# Altium schematic sheet 05 SOC_PWR.SchDoc
size 513 x 386 mm
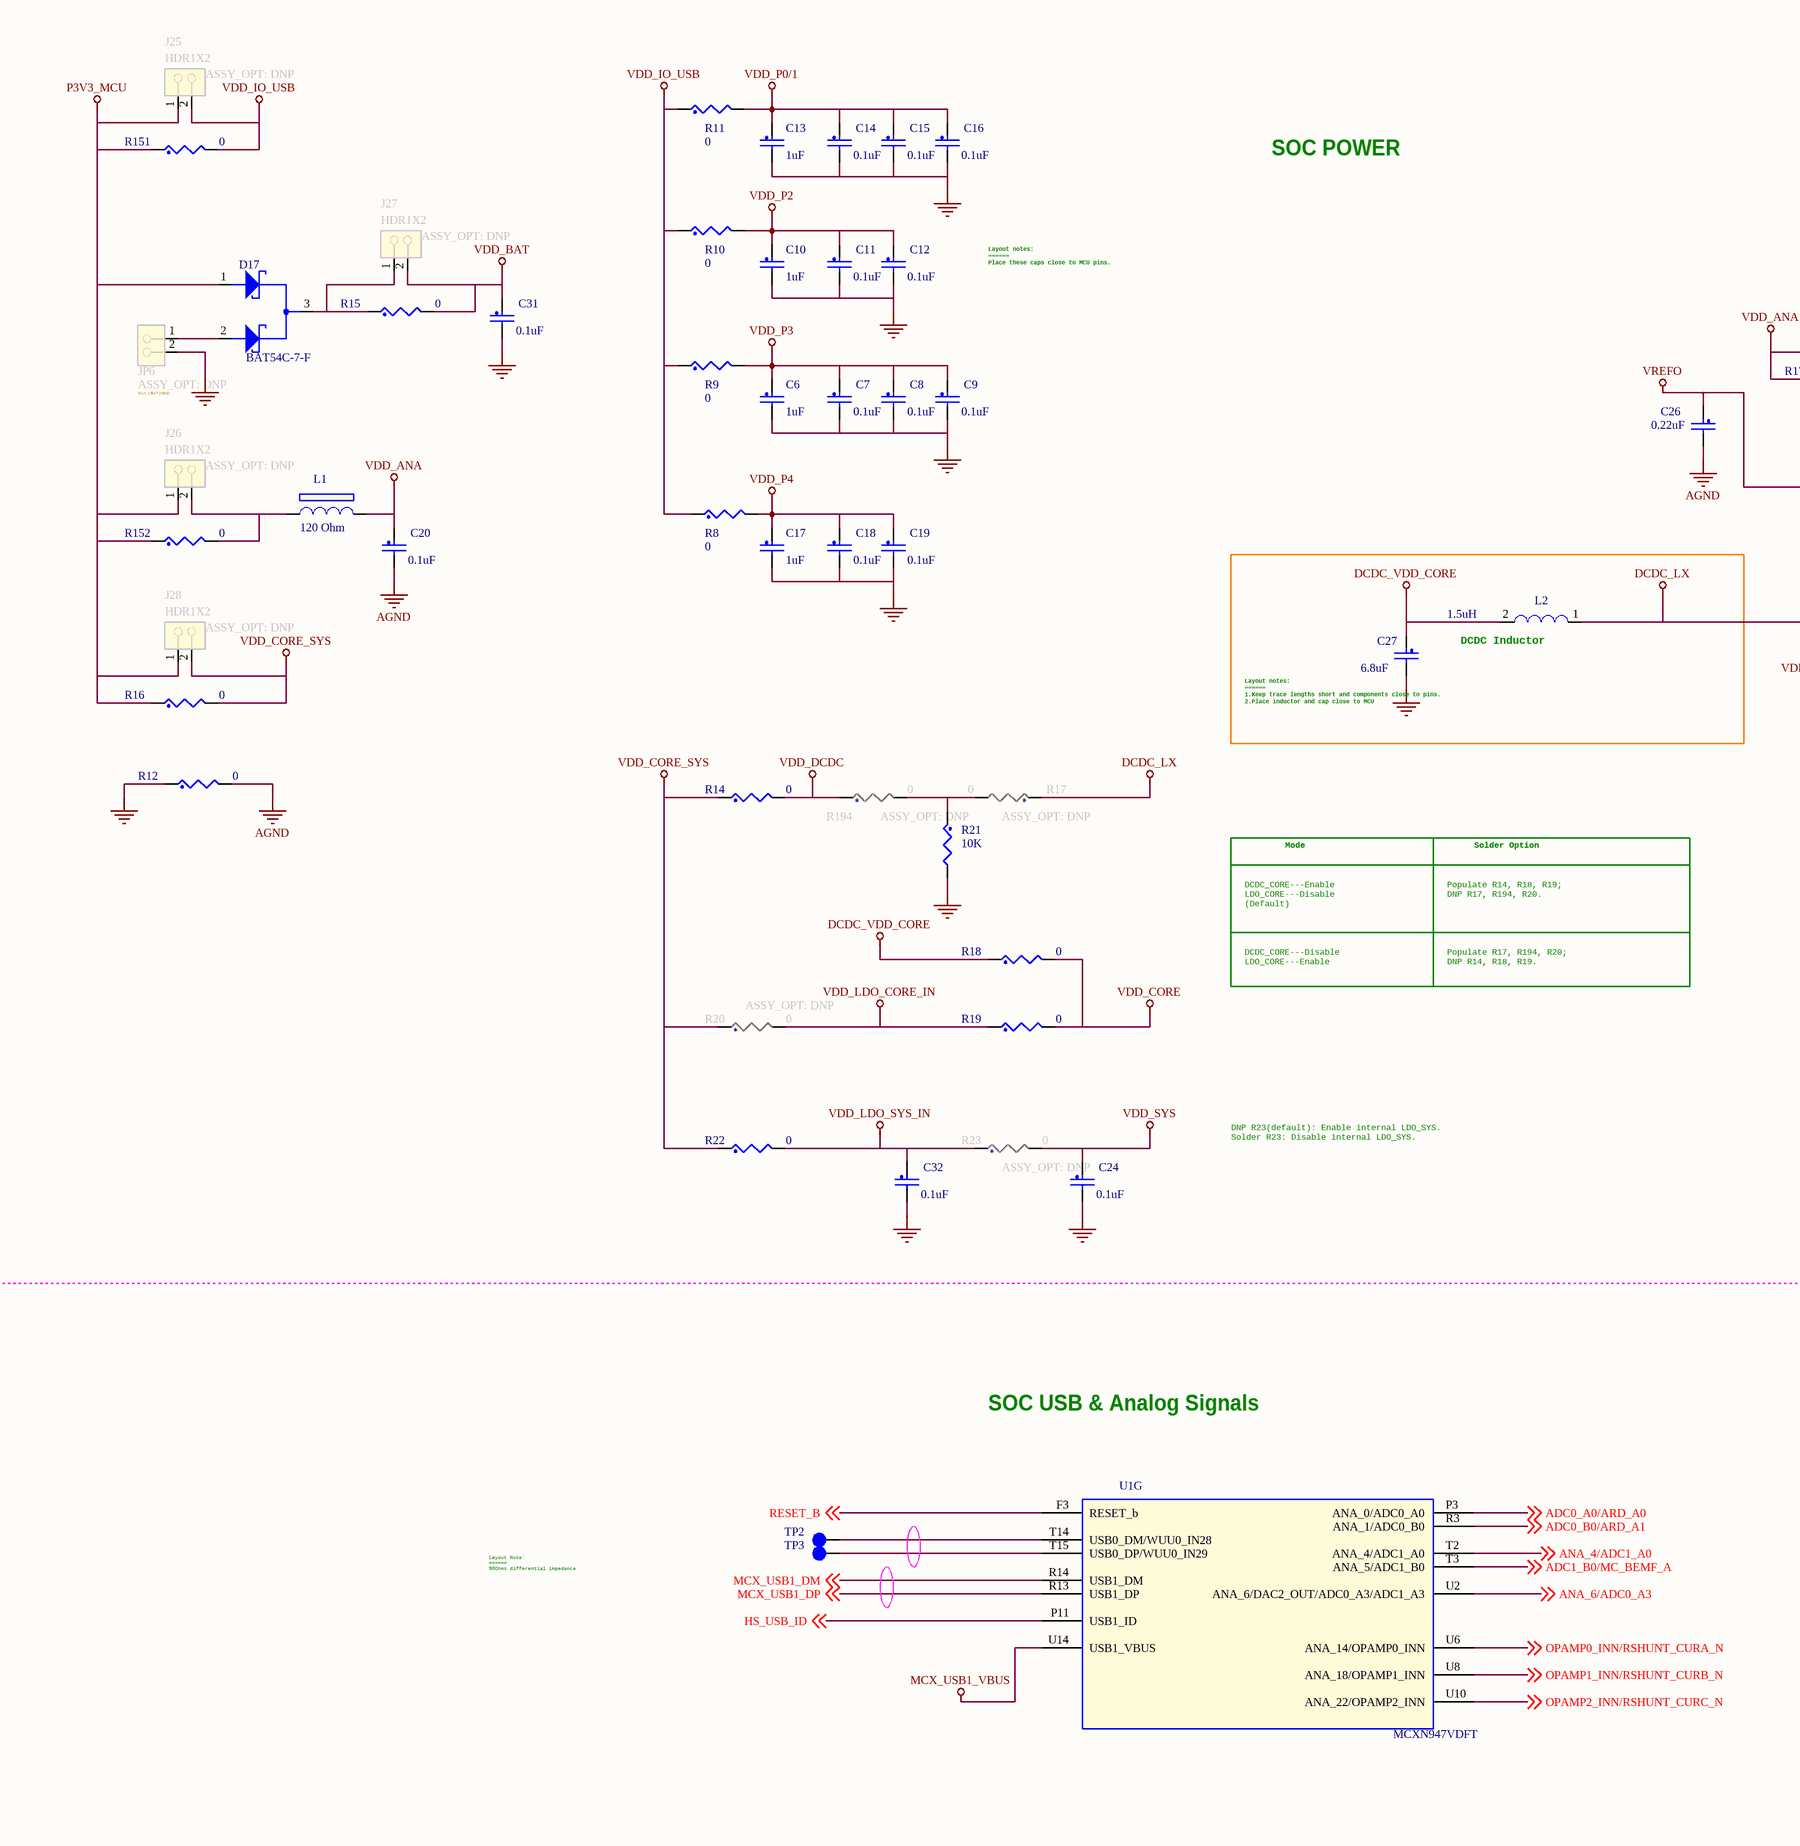
[diagram p0: 05 SOC_PWR.SchDoc, left]
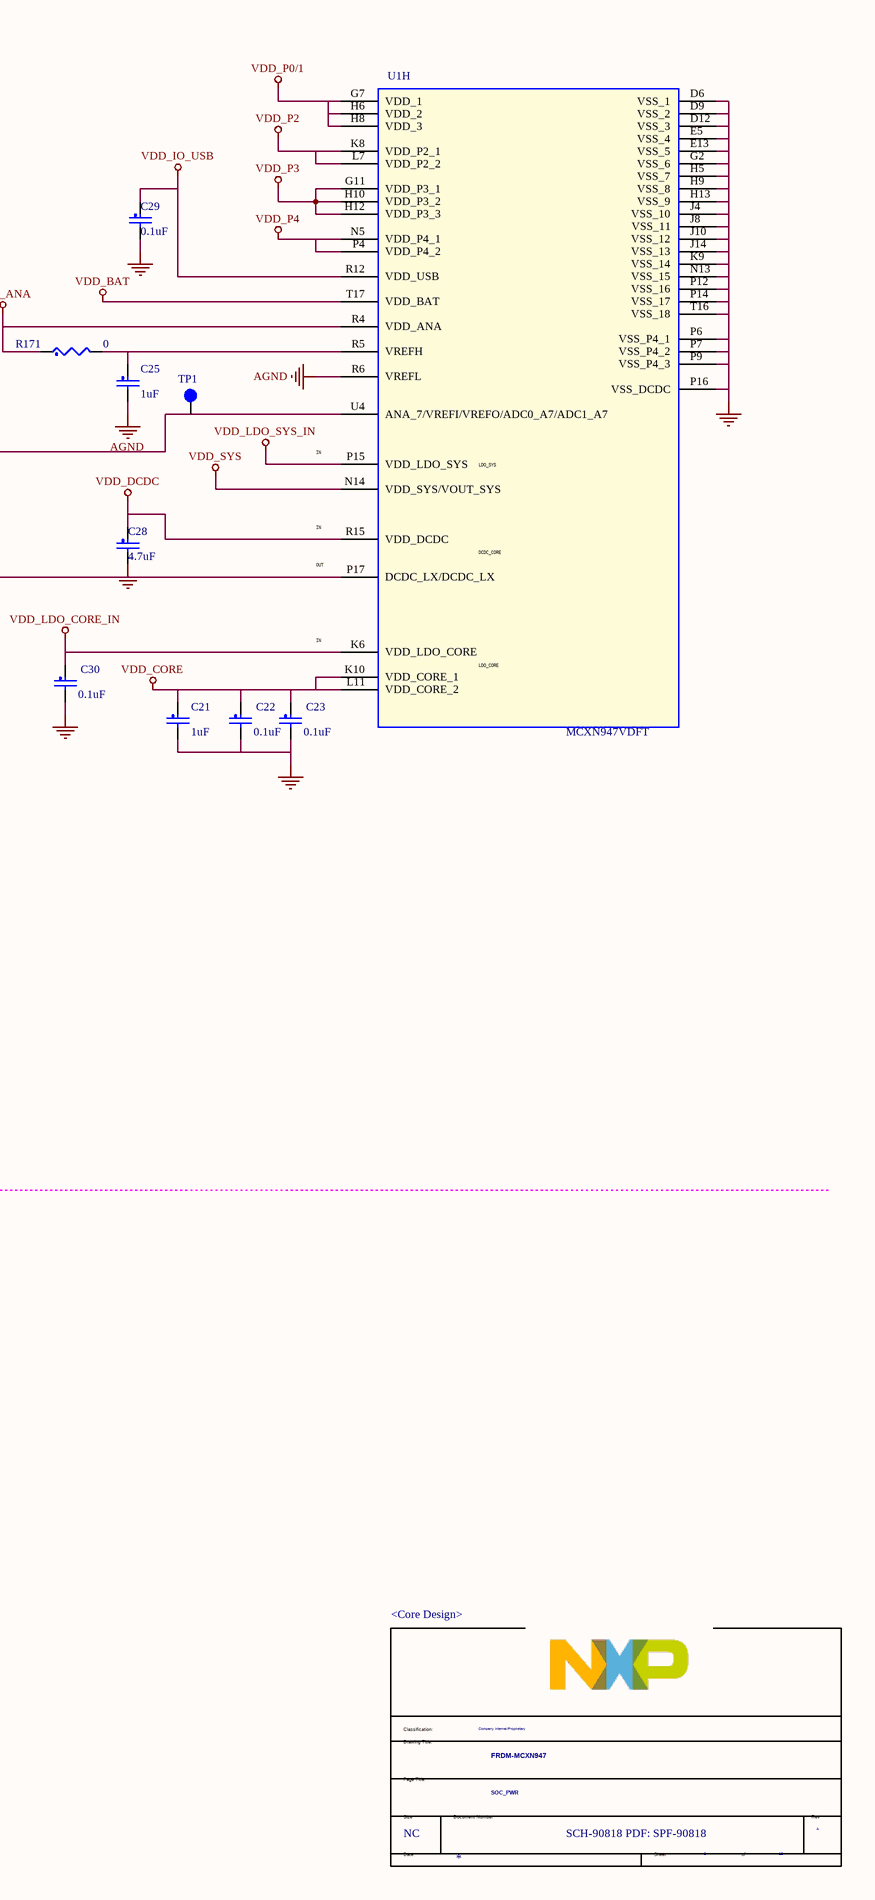
[diagram p1: 05 SOC_PWR.SchDoc, right]

## Parts
*  Doc: SCH-90818 PDF: SPF-90818  RevCode: A  Title: FRDM-MCXN947  Page Size: NC  Page Number: 5  Page Count: 13  PageTitle: SOC_PWR  Classification: Company Internal/Proprietary  Variant Name: <Core Design>  (hidden comment: TitleBlock_FS)  (graphical)
C6  1uF  [CC0603_OV]
C7  0.1uF  [CC0402_25]
C8  0.1uF  [CC0402_25]
C9  0.1uF  [CC0402_25]
C10  1uF  [CC0603_OV]
C11  0.1uF  [CC0402_25]
C12  0.1uF  [CC0402_25]
C13  1uF  [CC0603_OV]
C14  0.1uF  [CC0402_25]
C15  0.1uF  [CC0402_25]
C16  0.1uF  [CC0402_25]
C17  1uF  [CC0603_OV]
C18  0.1uF  [CC0402_25]
C19  0.1uF  [CC0402_25]
C20  0.1uF  [CC0402_25]
C21  1uF  [CC0603_OV]
C22  0.1uF  [CC0402_25]
C23  0.1uF  [CC0402_25]
C24  0.1uF  [CC0402_25]
C25  1uF  [CC0603_OV]
C26  0.22uF  [CC0402_25]
C27  6.8uF  [CC0603_OV]
C28  4.7uF  [CC0603_OV]
C29  0.1uF  [CC0402_25]
C30  0.1uF  [CC0402_25]
C31  0.1uF  [CC0402_25]
C32  0.1uF  [CC0402_25]
D17  BAT54C-7-F  [sot23-40x40]
J25  HDR1X2  ASSY_OPT: DNP  [hdr1x2_5p48x2p69]
J26  HDR1X2  ASSY_OPT: DNP  [hdr1x2_5p48x2p69]
J27  HDR1X2  ASSY_OPT: DNP  [hdr1x2_5p48x2p69]
J28  HDR1X2  ASSY_OPT: DNP  [hdr1x2_5p48x2p69]
JP6  ASSY_OPT: DNP  SILK: 1:BAT 2:GND  [hdr1x2_5p48x2p69]  (hidden comment: HDR1X2)
L1  120 Ohm  [IND_0402]
L2  1.5uH  [ind_sph2520]
R8  0  [RC0603_OV]
R9  0  [RC0603_OV]
R10  0  [RC0603_OV]
R11  0  [RC0603_OV]
R12  0  [RC0603_OV]
R14  0  [RC0603_OV]
R15  0  [RC0603_OV]
R16  0  [RC0603_OV]
R17  0  ASSY_OPT: DNP  [RC0603_OV]
R18  0  [RC0603_OV]
R19  0  [RC0603_OV]
R20  0  ASSY_OPT: DNP  [RC0603_OV]
R21  10K  [RC0402_25]
R22  0  [RC0603_OV]
R23  0  ASSY_OPT: DNP  [RC0603_OV]
R151  0  [RC0603_OV]
R152  0  [RC0603_OV]
R171  0  [RC0603_OV]
R194  0  ASSY_OPT: DNP  [RC0603_OV]
TP1  TPAD_030  [TPAD_030]  (value not drawn)
TP2  TPAD_030  [TPAD_030]  (value not drawn)
TP3  TPAD_030  [TPAD_030]  (value not drawn)
U1  MCXN947VDFT  [bga184_0p5_9x9_sm]  (parts G,H of 8)

## Blocks framed on the sheet
DCDC Inductor: C27 L2

## Nets
AGND: C20.2 C25.2 C26.2 R12.2 U1.R6(VREFL)
DCDC_LX: L2.1 R17.1 U1.P17(DCDC_LX/DCDC_LX)
DCDC_VDD_CORE: C27.1 L2.2 R18.1
GND: C6.2 C7.2 C8.2 C9.2 C10.2 C11.2 C12.2 C13.2 C14.2 C15.2 C16.2 C17.2 C18.2 C19.2 C21.2 C22.2 C23.2 C24.2 C27.2 C28.2 C29.2 C30.2 C31.2 C32.2 JP6.2 R12.1 R21.2 U1.D6(VSS_1) U1.D9(VSS_2) U1.D12(VSS_3) U1.E5(VSS_4) U1.E13(VSS_5) U1.G2(VSS_6) U1.H5(VSS_7) U1.H9(VSS_8) U1.H13(VSS_9) U1.J4(VSS_10) U1.J8(VSS_11) U1.J10(VSS_12) U1.J14(VSS_13) U1.K9(VSS_14) U1.N13(VSS_15) U1.P6(VSS_P4_1) U1.P7(VSS_P4_2) U1.P9(VSS_P4_3) U1.P12(VSS_16) U1.P14(VSS_17) U1.P16(VSS_DCDC) U1.T16(VSS_18)
MCX_USB1_VBUS: U1.U14(USB1_VBUS)
P3V3_MCU: D17.1(A1) J25.1 J26.1 J28.1 R16.1 R151.1 R152.1
VDD_ANA: C20.1 L1.2 R171.1 U1.R4(VDD_ANA)
VDD_BAT: C31.1 J27.2 R15.2 U1.T17(VDD_BAT)
VDD_CORE: C21.1 C22.1 C23.1 R18.2 R19.2 U1.K10(VDD_CORE_1) U1.L11(VDD_CORE_2)
VDD_CORE_SYS: J28.2 R14.1 R16.2 R20.1 R22.1
VDD_DCDC: C28.1 R14.2 R194.1 U1.R15(VDD_DCDC)
VDD_IO_USB: C29.1 J25.2 R8.1 R9.1 R10.1 R11.1 R151.2 U1.R12(VDD_USB)
VDD_LDO_CORE_IN: C30.1 R19.1 R20.2 U1.K6(VDD_LDO_CORE)
VDD_LDO_SYS_IN: C32.1 R22.2 R23.1 U1.P15(VDD_LDO_SYS)
VDD_P0/1: C13.1 C14.1 C15.1 C16.1 R11.2 U1.G7(VDD_1) U1.H6(VDD_2) U1.H8(VDD_3)
VDD_P2: C10.1 C11.1 C12.1 R10.2 U1.K8(VDD_P2_1) U1.L7(VDD_P2_2)
VDD_P3: C6.1 C7.1 C8.1 C9.1 R9.2 U1.G11(VDD_P3_1) U1.H10(VDD_P3_2) U1.H12(VDD_P3_3)
VDD_P4: C17.1 C18.1 C19.1 R8.2 U1.N5(VDD_P4_1) U1.P4(VDD_P4_2)
VDD_SYS: C24.1 R23.2 U1.N14(VDD_SYS/VOUT_SYS)
VREFO: C26.1 TP1.1(Pin1) U1.U4(ANA_7/VREFI/VREFO/ADC0_A7/ADC1_A7)
ADC0_A0/ARD_A0: U1.P3(ANA_0/ADC0_A0) ; off-sheet ADC0_A0/ARD_A0
ADC0_B0/ARD_A1: U1.R3(ANA_1/ADC0_B0) ; off-sheet ADC0_B0/ARD_A1
ADC1_B0/MC_BEMF_A: U1.T3(ANA_5/ADC1_B0) ; off-sheet ADC1_B0/MC_BEMF_A
ANA_4/ADC1_A0: U1.T2(ANA_4/ADC1_A0) ; off-sheet ANA_4/ADC1_A0
ANA_6/ADC0_A3: U1.U2(ANA_6/DAC2_OUT/ADC0_A3/ADC1_A3) ; off-sheet ANA_6/ADC0_A3
HS_USB_ID: U1.P11(USB1_ID) ; off-sheet HS_USB_ID
MCX_USB1_DM: U1.R14(USB1_DM) ; off-sheet MCX_USB1_DM
MCX_USB1_DP: U1.R13(USB1_DP) ; off-sheet MCX_USB1_DP
OPAMP0_INN/RSHUNT_CURA_N: U1.U6(ANA_14/OPAMP0_INN) ; off-sheet OPAMP0_INN/RSHUNT_CURA_N
OPAMP1_INN/RSHUNT_CURB_N: U1.U8(ANA_18/OPAMP1_INN) ; off-sheet OPAMP1_INN/RSHUNT_CURB_N
OPAMP2_INN/RSHUNT_CURC_N: U1.U10(ANA_22/OPAMP2_INN) ; off-sheet OPAMP2_INN/RSHUNT_CURC_N
RESET_B: U1.F3(RESET_b) ; off-sheet RESET_B
NetC25_1: C25.1 R171.2 U1.R5(VREFH)
NetD17_2: D17.2(A2) JP6.1
NetD17_3: D17.3(C) J27.1 R15.1
NetJ26_2: J26.2 L1.1 R152.2
NetR17_2: R17.2 R21.1 R194.2
NetTP2_1: TP2.1(Pin1) U1.T14(USB0_DM/WUU0_IN28)
NetTP3_1: TP3.1(Pin1) U1.T15(USB0_DP/WUU0_IN29)

## Notes on the sheet
- SOC POWER
- Layout notes:
  ======
  Place these caps close to MCU pins.
- IN
- (near U1) LDO_SYS
- OUT
- (near U1) DCDC_CORE
- (near C27) Layout notes:
  ======
  1.Keep trace lengths short and components close to pins.
  2.Place inductor and cap close to MCU
- (near U1) LDO_CORE
- DCDC_CORE---Enable
  LDO_CORE---Disable
  (Default)
- Mode
- Populate R14, R18, R19;
  DNP R17, R194, R20.
- Solder Option
- DCDC_CORE---Disable
  LDO_CORE---Enable
- Populate R17, R194, R20;
  DNP R14, R18, R19.
- DNP R23(default): Enable internal LDO_SYS.
  Solder R23: Disable internal LDO_SYS.
- SOC USB & Analog Signals
- Layout Note:
  ======
  90Ohms differential impedance
- (in symbol TitleBlock_FS) Classification:; Drawing Title:; Page Title:; Size; Document Number; Rev; Date:; Sheet; of

## Library data of the parts
* = TitleBlock_FS: Classification: Public, Company Internal/Proprietary, Company Confidential,  Company Secret; OrgAddr2: Austin, TX 78735-8598; OrgAddr1: 6501 William Cannon Drive West; OrgName: NXP Semiconductors; Page Create Date: March  8, 1995; Page Modify Date: *
C6 = CAP_NP: CAP CER 1uF 16V 20% X5R 0603; CLASS: DISCRETE; Temp_Range: -55°C to +125°C; SIGNAL_MODEL: DEFAULT_CAPACITOR_1e+06pF_2_1; AGILE_PN: 150-81891; MFG_NAME01: WURTH ELEKTRONIK; MFG_PN01: 885012106017; CAD_APPROVED: Yes; FPLIST: CC0603_OV,CC0603,0603_CC; Temp Range: -55C TO 85C; PCB Footprint: CC0603_OV; Tolerance: 20%; ROHS: Yes; HEIGHT: 0.87MM; VOLTAGE: 16V; Package Size: 0603; Package Type: WCAP-CSGP_0603; Rated Voltage: 16V; 3D_Mechanical_Footprint_File: http://fcl.am.freescale.net/ALLEGRO/step/cc0603_ov.STEP
C7-C9 C20 C29 C32 = CAP_NP: CAP CER 0.1UF 16V 10% X7R 0402; CLASS: DISCRETE; Temp_Range: -55°C to +85°C; FPLIST: CC0402_25,CC0402_HD,0402_CC,CAPC0402_L,cc0402_lamp3; CAD_APPROVED: Yes; MFG_PN01: CL05B104KO5NNNC; MFG_NAME01: Samsung Electro-Mechanics; AGILE_PN: 150-75182; SIGNAL_MODEL: DEFAULT_CAPACITOR_100000pF_2_1; Temp Range: -55C to +125C; PCB Footprint: CC0402_25; VOLTAGE: 16V; TOL: 10%; HEIGHT: 0.635MM; ROHS: Yes; Tolerance: 10%; Rated Voltage: 16V; 3D_Mechanical_Footprint_File: http://fcl.am.freescale.net/ALLEGRO/step/cc0402_25.STEP
C10 C21 = CAP_NP: CAP CER 1uF 16V 20% X5R 0603; CLASS: DISCRETE; Temp Range: -55C TO 85C; Temp_Range: -55°C to +125°C; SIGNAL_MODEL: DEFAULT_CAPACITOR_1e+06pF_2_1; AGILE_PN: 150-81891; MFG_NAME01: WURTH ELEKTRONIK; MFG_PN01: 885012106017; CAD_APPROVED: Yes; FPLIST: CC0603_OV,CC0603,0603_CC; PCB Footprint: CC0603_OV; 3D_Mechanical_Footprint_File: http://fcl.am.freescale.net/ALLEGRO/step/cc0603_ov.STEP; Rated Voltage: 16V; Package Type: WCAP-CSGP_0603; Package Size: 0603; Tolerance: 20%; ROHS: Yes; HEIGHT: 0.87MM; VOLTAGE: 16V
C11 C12 C22 C23 = CAP_NP: CAP CER 0.1UF 16V 10% X7R 0402; CLASS: DISCRETE; Temp Range: -55C to +125C; Temp_Range: -55°C to +85°C; FPLIST: CC0402_25,CC0402_HD,0402_CC,CAPC0402_L,cc0402_lamp3; CAD_APPROVED: Yes; MFG_PN01: CL05B104KO5NNNC; MFG_NAME01: Samsung Electro-Mechanics; AGILE_PN: 150-75182; SIGNAL_MODEL: DEFAULT_CAPACITOR_100000pF_2_1; PCB Footprint: CC0402_25; 3D_Mechanical_Footprint_File: http://fcl.am.freescale.net/ALLEGRO/step/cc0402_25.STEP; Rated Voltage: 16V; VOLTAGE: 16V; TOL: 10%; HEIGHT: 0.635MM; ROHS: Yes; Tolerance: 10%
C13 C25 = CAP_NP: CAP CER 1uF 16V 20% X5R 0603; CLASS: DISCRETE; Temp Range: -55C TO 85C; FPLIST: CC0603_OV,CC0603,0603_CC; CAD_APPROVED: Yes; MFG_PN01: 885012106017; MFG_NAME01: WURTH ELEKTRONIK; AGILE_PN: 150-81891; SIGNAL_MODEL: DEFAULT_CAPACITOR_1e+06pF_2_1; Temp_Range: -55°C to +125°C; PCB Footprint: CC0603_OV; 3D_Mechanical_Footprint_File: http://fcl.am.freescale.net/ALLEGRO/step/cc0603_ov.STEP; Rated Voltage: 16V; Package Type: WCAP-CSGP_0603; Package Size: 0603; VOLTAGE: 16V; HEIGHT: 0.87MM; ROHS: Yes; Tolerance: 20%
C14-C16 C24 C30 C31 = CAP_NP: CAP CER 0.1UF 16V 10% X7R 0402; CLASS: DISCRETE; Temp Range: -55C to +125C; SIGNAL_MODEL: DEFAULT_CAPACITOR_100000pF_2_1; AGILE_PN: 150-75182; MFG_NAME01: Samsung Electro-Mechanics; MFG_PN01: CL05B104KO5NNNC; CAD_APPROVED: Yes; FPLIST: CC0402_25,CC0402_HD,0402_CC,CAPC0402_L,cc0402_lamp3; Temp_Range: -55°C to +85°C; PCB Footprint: CC0402_25; 3D_Mechanical_Footprint_File: http://fcl.am.freescale.net/ALLEGRO/step/cc0402_25.STEP; Rated Voltage: 16V; Tolerance: 10%; ROHS: Yes; HEIGHT: 0.635MM; TOL: 10%; VOLTAGE: 16V
C17 = CAP_NP: CAP CER 1uF 16V 20% X5R 0603; CLASS: DISCRETE; FPLIST: CC0603_OV,CC0603,0603_CC; CAD_APPROVED: Yes; MFG_PN01: 885012106017; MFG_NAME01: WURTH ELEKTRONIK; AGILE_PN: 150-81891; SIGNAL_MODEL: DEFAULT_CAPACITOR_1e+06pF_2_1; Temp_Range: -55°C to +125°C; Temp Range: -55C TO 85C; PCB Footprint: CC0603_OV; VOLTAGE: 16V; HEIGHT: 0.87MM; ROHS: Yes; Tolerance: 20%; Package Size: 0603; Package Type: WCAP-CSGP_0603; Rated Voltage: 16V; 3D_Mechanical_Footprint_File: http://fcl.am.freescale.net/ALLEGRO/step/cc0603_ov.STEP
C18 C19 = CAP_NP: CAP CER 0.1UF 16V 10% X7R 0402; CLASS: DISCRETE; SIGNAL_MODEL: DEFAULT_CAPACITOR_100000pF_2_1; AGILE_PN: 150-75182; MFG_NAME01: Samsung Electro-Mechanics; MFG_PN01: CL05B104KO5NNNC; CAD_APPROVED: Yes; FPLIST: CC0402_25,CC0402_HD,0402_CC,CAPC0402_L,cc0402_lamp3; Temp_Range: -55°C to +85°C; Temp Range: -55C to +125C; PCB Footprint: CC0402_25; Tolerance: 10%; ROHS: Yes; HEIGHT: 0.635MM; TOL: 10%; VOLTAGE: 16V; Rated Voltage: 16V; 3D_Mechanical_Footprint_File: http://fcl.am.freescale.net/ALLEGRO/step/cc0402_25.STEP
C26 = CAP_NP: CAP CER 0.22UF 16V 10% X7R 0402; CLASS: DISCRETE; AGILE_PN: 150-78886; MFG_NAME01: FENGHUA; MFG_PN01: 0402B224K160NT; CAD_APPROVED: Yes; FPLIST: CC0402_25,CC0402_HD,0402_CC; Temp Range: -55C to +125C; PCB Footprint: CC0402_25; Tolerance: 10%; ROHS: Yes; HEIGHT: 0.55MM; VOLTAGE: 16V; Package Size: 0402 [1005 Metric]; Package Type: SMD/SMT; Rated Voltage: 16V; 3D_Mechanical_Footprint_File: http://fcl.am.freescale.net/ALLEGRO/step/cc0402_25.STEP
C27 = CAP_NP: CAP CER 6.8uF 6.3V 10% X7S 0603; CLASS: DISCRETE; Temp Range: -55C to +125C; FPLIST: CC0603_OV,CC0603,0603_CC; CAD_APPROVED: Yes; MFG_PN01: C1608X7S0J685K080AC; MFG_NAME01: TDK; AGILE_PN: 150-79711; Rated Voltage: 6.3V; Package Type: Reel; Package Size: 0603; VOLTAGE: 6.3V; HEIGHT: 1MM; ROHS: Yes; Tolerance: 10%; PCB Footprint: CC0603_OV
C28 = CAP_NP: CAP CER 4.7uF 10V 20% X5R 0603; CLASS: DISCRETE; Temp Range: -55C TO 85C; TOL: 10%; FPLIST: CC0603_OV,CC0603,0603_CC; CAD_APPROVED: Yes; MFG_PN01: 885012106012; MFG_NAME01: WURTH ELEKTRONIK; AGILE_PN: 150-81893; ROOM: CPU; SIGNAL_MODEL: DEFAULT_CAPACITOR_220000pF_2_1; 3D_Mechanical_Footprint_File: http://fcl.am.freescale.net/ALLEGRO/step/cc0603_ov.STEP; Rated Voltage: 10V; Package Type: WCAP-CSGP_0603; Package Size: 0603; VOLTAGE: 10V; WVDC: 10V; HEIGHT: 0.87MM; ROHS: Yes; Tolerance: 20%; PCB Footprint: CC0603_OV
D17 = DUALDIODE_CC_SOT23_SHTKY: DIODE SCH DUAL CC 200MA 30V SOT23; CLASS: IC; AGILE_PN: 480-78365; CAD_APPROVED: Yes; MFG_NAME01: DIODES INC; HEIGHT: 1.2MM; MFG_PN01: BAT54C-7-F; 3D_Mechanical_Footprint_File: http://fcl.am.freescale.net/ALLEGRO/step/sot23-40x40.STEP; PCB Footprint: sot23-40x40
J25 J26 = CONN_HDR_2X1: HDR 1X2 TH 100MIL SP 342H AU 118L; CLASS: IO; MFG_PN01: 61300211121; MFG_NAME01: WURTH ELEKTRONIK EISOS GMBH & CO. KG (ELECTRONIC & ELECTROMEHANICAL COMP); Temp Range: -40¡ãC to 105¡ãC; CAD_APPROVED: Yes; AGILE_PN: 210-80468; PCB Footprint: hdr1x2_5p48x2p69; 3D_Mechanical_Footprint_File: http://fcl.am.freescale.net/ALLEGRO/step/hdr1x2_5p48x2p69.STEP; ROHS: Yes; Package Type: TH; HEIGHT: 8.69MM
J27 J28 JP6 = CONN_HDR_2X1: HDR 1X2 TH 100MIL SP 342H AU 118L; CLASS: IO; AGILE_PN: 210-80468; CAD_APPROVED: Yes; Temp Range: -40¡ãC to 105¡ãC; MFG_NAME01: WURTH ELEKTRONIK EISOS GMBH & CO. KG (ELECTRONIC & ELECTROMEHANICAL COMP); MFG_PN01: 61300211121; PCB Footprint: hdr1x2_5p48x2p69; HEIGHT: 8.69MM; Package Type: TH; ROHS: Yes; 3D_Mechanical_Footprint_File: http://fcl.am.freescale.net/ALLEGRO/step/hdr1x2_5p48x2p69.STEP
L1 = INDUCTOR_FERRITE: IND FER BEAD 120 OHM@100MHZ 0.5A 25% 0402; CLASS: DISCRETE; AGILE_PN: 180-77771; FPLIST: IND_0402,0402_CC; CAD_APPROVED: Yes; MFG_NAME01: MURATA; MFG_PN01: BLM15AG121SN1D; PCB Footprint: IND_0402; Package Size: 0402; HEIGHT: 0.55MM; ROHS: Yes
L2 = INDUCTOR: IND WW PWR 1.5uH@1MHZ 2A 20% 2520; CLASS: DISCRETE; AGILE_PN: 180-78270; CAD_APPROVED: Yes; MFG_NAME01: SHENZHEN SUNLORD ELECTRONICS CO., LTD; MFG_PN01: SPH252012H1R5MT; HEIGHT: 1.2MM; ROHS: Yes; PCB Footprint: ind_sph2520
R8 R9 R11 R15-R20 R23 R151 R152 = RES: RES MF ZERO OHM 1/10W -- 0603; CLASS: DISCRETE; AGILE_PN: 470-80866; FPLIST: RC0603_OV,RC0603,R603-X2,r603-x2_b,0603_CC,IND_0603HP_NSP,CC0603_OV_NSP; CAD_APPROVED: Yes; Temp Range: ¨C55 ¡ãC to +155 ¡ãC; MFG_NAME01: YAGEO AMERICA; MFG_PN01: RC0603FR-070RL; PCB Footprint: RC0603_OV; HEIGHT: 0.6MM; ROHS: Yes
R10 R12 R14 R22 R171 R194 = RES: RES MF ZERO OHM 1/10W -- 0603; CLASS: DISCRETE; MFG_PN01: RC0603FR-070RL; MFG_NAME01: YAGEO AMERICA; Temp Range: ¨C55 ¡ãC to +155 ¡ãC; CAD_APPROVED: Yes; FPLIST: RC0603_OV,RC0603,R603-X2,r603-x2_b,0603_CC,IND_0603HP_NSP,CC0603_OV_NSP; AGILE_PN: 470-80866; PCB Footprint: RC0603_OV; ROHS: Yes; HEIGHT: 0.6MM
R21 = RES: RES MF 10K 1/16W 1% 0402; CLASS: DISCRETE; SIGNAL_MODEL: DEFAULT_RESISTOR_10000OHM_2_1; AGILE_PN: 470-80452; MFG_NAME01: NIC COMPONENTS CORP; MFG_PN01: NRCL04F1002TRF; CAD_APPROVED: Yes; FPLIST: RC0402_25,RC0402_HD,0402_CC,RC0402_X2; TOL: 5%; Temp_Range: –55 °C to +155 °C; PCB Footprint: RC0402_25; Tolerance: 1%; ROHS: Yes; HEIGHT: 0.40 MM
TP1 TP2 = TESTLOOP: TEST POINT PAD 30MIL DIA SMT, NO PART TO ORDER; CLASS: IO; AGILE_PN: 211-76642; MFG_NAME01: NOTACOMPONENT; CAD_APPROVED: Yes; PCB Footprint: TPAD_030; 3D_Mechanical_Footprint_File: http://fcl.am.freescale.net/ALLEGRO/step/tpad_030.STEP; MFG_PN01: NOTACOMPONENT; ROHS: Yes; HEIGHT: 0.1MM
TP3 = TESTLOOP: TEST POINT PAD 30MIL DIA SMT, NO PART TO ORDER; CLASS: IO; CAD_APPROVED: Yes; MFG_PN01: NOTACOMPONENT; AGILE_PN: 211-76642; PCB Footprint: TPAD_030; HEIGHT: 0.1MM; ROHS: Yes; MFG_NAME01: NOTACOMPONENT; 3D_Mechanical_Footprint_File: http://fcl.am.freescale.net/ALLEGRO/step/tpad_030.STEP
U1 = MCXN947VDFT_BGA_184P: IC MCU LOW POWER 150MHz ARM Nirvana -- VFBGA184; SPLIT_INST: TRUE; AGILE_PN: TMP-CIP-10342; CAD_APPROVED: Yes; PRE_APN: 344-02549; Temp Range: -40  ¡ãC to +105 ¡ãC; MFG_NAME01: NXP SEMICONDUCTOR; CLASS: IC; Package Size: 9x9; HEIGHT: 0.98 MM; ROHS: Yes; MFG_PN01: MCXN947VDFT; 3D_Mechanical_Footprint_File: http://fcl.am.freescale.net/ALLEGRO/step/bga184_0p5_9x9_sm.STEP; PCB Footprint: bga184_0p5_9x9_sm